# EAGLE design due (EAGLE 9.6.2)
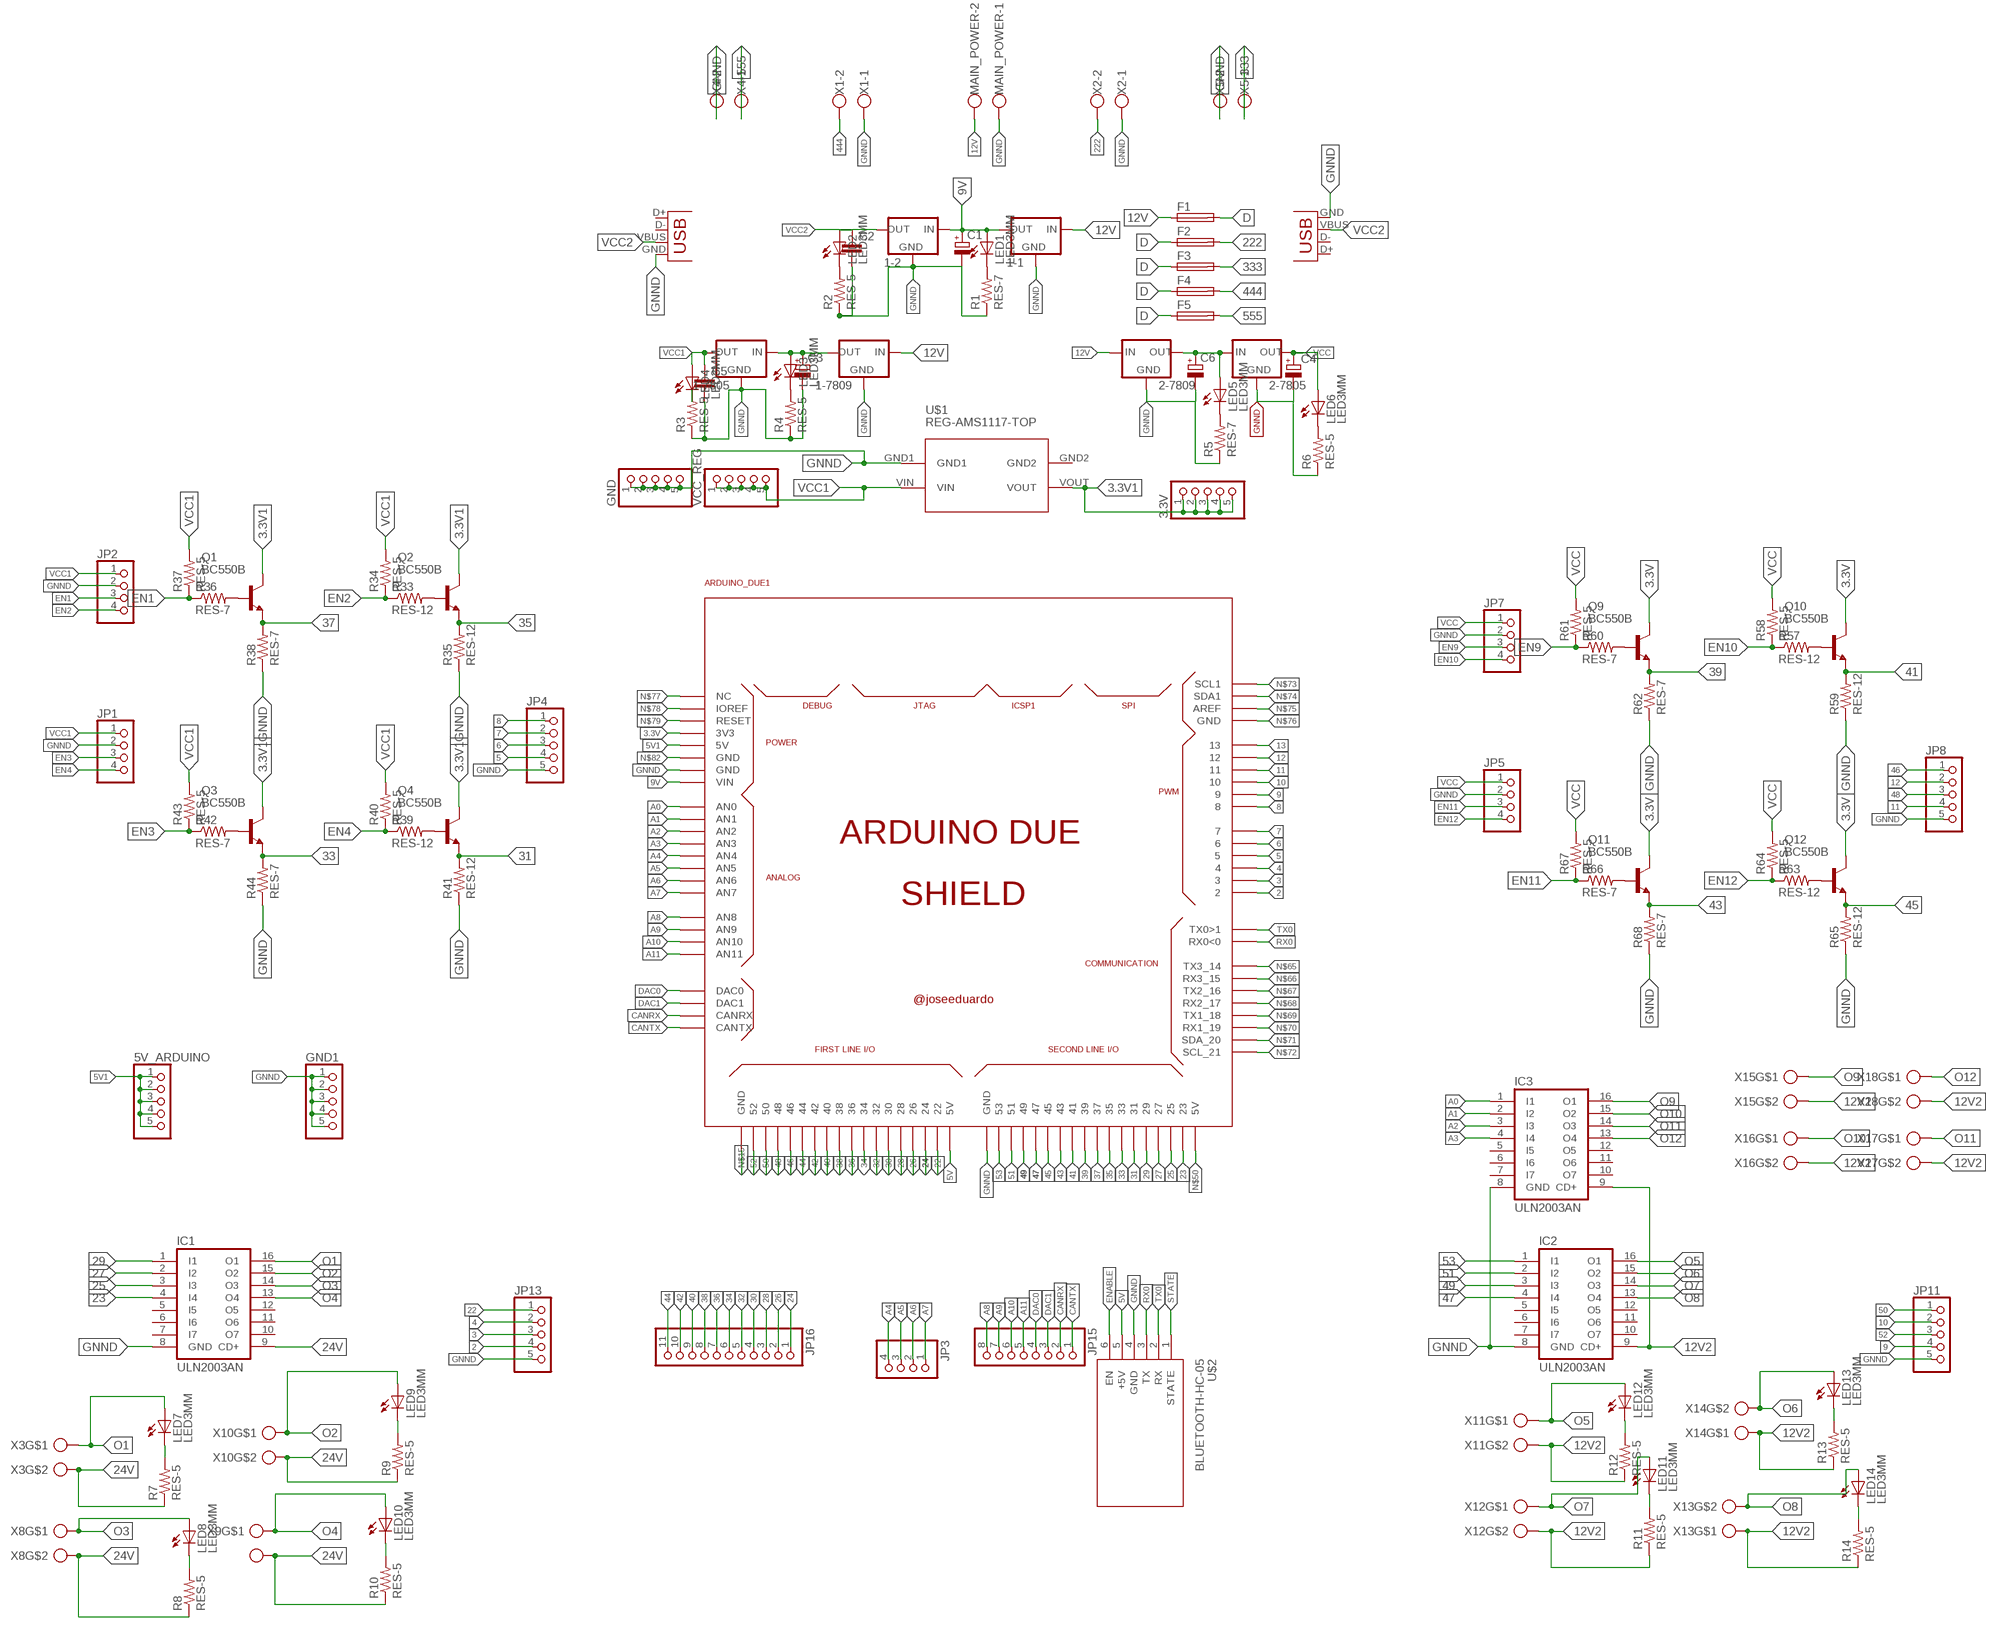
[diagram p0: schematic, sheet 1]

## Parts
1-1  78XXS  [78XXS]
1-2  78XXS  [78XXS]
1-7805  78XXS  [78XXS]
1-7809  78XXS  [78XXS]
2-7805  78XXS  [78XXS]
2-7809  78XXS  [78XXS]
3.3V  PINHD-1X5  [1X05]
5V_ARDUINO  PINHD-1X5  [1X05]
ARDUINO_DUE1  ARDUINO_DUE_SHIELD  [ARDUINO_DUE_SHIELD]
C1  CAP_POL  [E3,5-8]
C2  CAPACITOR  [C025-025X050]
C3  CAP_POL  [E3,5-8]
C4  CAP_POL  [E3,5-8]
C5  CAPACITOR  [C025-025X050]
C6  CAP_POL  [E3,5-8]
F1  FUSE_HOLDER  [SH22,5A]
F2  FUSE_HOLDER  [SH22,5A]
F3  FUSE_HOLDER  [SH22,5A]
F4  FUSE_HOLDER  [SH22,5A]
F5  FUSE_HOLDER  [SH22,5A]
GND  PINHD-1X5  [1X05]
GND1  PINHD-1X5  [1X05]
IC1  ULN2003AN  [DIL16]
IC2  ULN2003AN  [DIL16]
IC3  ULN2003AN  [DIL16]
JP1  PINHD-1X4  [1X04]
JP2  PINHD-1X4  [1X04]
JP3  PINHD-1X4  [1X04]
JP4  PINHD-1X5  [1X05]
JP5  PINHD-1X4  [1X04]
JP7  PINHD-1X4  [1X04]
JP8  PINHD-1X5  [1X05]
JP11  PINHD-1X5  [1X05]
JP13  PINHD-1X5  [1X05]
JP15  PINHD-1X8  [1X08]
JP16  PINHD-1X11  [1X11]
LED1  LED3MM  [LED3MM]
LED2  LED3MM  [LED3MM]
LED3  LED3MM  [LED3MM]
LED4  LED3MM  [LED3MM]
LED5  LED3MM  [LED3MM]
LED6  LED3MM  [LED3MM]
LED7  LED3MM  [LED3MM]
LED8  LED3MM  [LED3MM]
LED9  LED3MM  [LED3MM]
LED10  LED3MM  [LED3MM]
LED11  LED3MM  [LED3MM]
LED12  LED3MM  [LED3MM]
LED13  LED3MM  [LED3MM]
LED14  LED3MM  [LED3MM]
MAIN_POWER  ROSTA.POWER  [W239-302]
Q1  BC550B  [TO92-EBC]
Q2  BC550B  [TO92-EBC]
Q3  BC550B  [TO92-EBC]
Q4  BC550B  [TO92-EBC]
Q9  BC550B  [TO92-EBC]
Q10  BC550B  [TO92-EBC]
Q11  BC550B  [TO92-EBC]
Q12  BC550B  [TO92-EBC]
R1  RES-7  [0204/7]
R2  RES-5  [0204/5]
R3  RES-5  [0204/5]
R4  RES-5  [0204/5]
R5  RES-7  [0204/7]
R6  RES-5  [0204/5]
R7  RES-5  [0204/5]
R8  RES-5  [0204/5]
R9  RES-5  [0204/5]
R10  RES-5  [0204/5]
R11  RES-5  [0204/5]
R12  RES-5  [0204/5]
R13  RES-5  [0204/5]
R14  RES-5  [0204/5]
R33  RES-12  [0207/12]
R34  RES-5  [0204/5]
R35  RES-12  [0207/12]
R36  RES-7  [0204/7]
R37  RES-5  [0204/5]
R38  RES-7  [0204/7]
R39  RES-12  [0207/12]
R40  RES-5  [0204/5]
R41  RES-12  [0207/12]
R42  RES-7  [0204/7]
R43  RES-5  [0204/5]
R44  RES-7  [0204/7]
R57  RES-12  [0207/12]
R58  RES-5  [0204/5]
R59  RES-12  [0207/12]
R60  RES-7  [0204/7]
R61  RES-5  [0204/5]
R62  RES-7  [0204/7]
R63  RES-12  [0207/12]
R64  RES-5  [0204/5]
R65  RES-12  [0207/12]
R66  RES-7  [0204/7]
R67  RES-5  [0204/5]
R68  RES-7  [0204/7]
U$1  REG-AMS1117-TOP  [REG-AMS1117_TOP]
U$2  BLUETOOTH-HC-05  [WIRELESS-BLUETOOTH-HC-05]
VCC_REG  PINHD-1X5  [1X05]
X1  ROSTA.POWER  [W239-302]
X2  ROSTA.POWER  [W239-302]
X3  CON_PTR_2  [AK300/2]
X4  ROSTA.POWER  [W239-302]
X5  ROSTA.POWER  [W239-302]
X6  USB-A-H  [USB-A-H]
X7  USB-A-H  [USB-A-H]
X8  CON_PTR_2  [AK300/2]
X9  CON_PTR_2  [AK300/2]
X10  CON_PTR_2  [AK300/2]
X11  CON_PTR_2  [AK300/2]
X12  CON_PTR_2  [AK300/2]
X13  CON_PTR_2  [AK300/2]
X14  CON_PTR_2  [AK300/2]
X15  CON_PTR_2  [AK300/2]
X16  CON_PTR_2  [AK300/2]
X17  CON_PTR_2  [AK300/2]
X18  CON_PTR_2  [AK300/2]

## Nets
2: ARDUINO_DUE1.2 JP13.4
3: ARDUINO_DUE1.3 JP13.3
3.3V: ARDUINO_DUE1.3V3 Q9.C Q10.C Q11.C Q12.C
3.3V1: 3.3V.1 3.3V.2 3.3V.3 3.3V.4 3.3V.5 Q1.C Q2.C Q3.C Q4.C U$1.VOUT
4: ARDUINO_DUE1.4 JP13.2
5: ARDUINO_DUE1.5 JP4.4
5V: ARDUINO_DUE1.5V0_1(5V) U$2.5(+5V)
5V1: 5V_ARDUINO.1 5V_ARDUINO.2 5V_ARDUINO.3 5V_ARDUINO.4 5V_ARDUINO.5 ARDUINO_DUE1.5V0(5V)
6: ARDUINO_DUE1.6 JP4.3
7: ARDUINO_DUE1.7 JP4.2
8: ARDUINO_DUE1.8 JP4.1
9: ARDUINO_DUE1.9 JP11.4
9V: 1-1.OUT 1-2.IN ARDUINO_DUE1.VIN C1.+ LED1.A
10: ARDUINO_DUE1.10 JP11.2
11: ARDUINO_DUE1.11 JP8.4
12: ARDUINO_DUE1.12 JP8.2
12V: 1-1.IN 1-7809.IN 2-7809.IN F1.1 MAIN_POWER.2
12V2: IC2.9(CD+) IC3.9(CD+) R11.1 R12.1 R13.1 R14.1 X11.2 X12.2 X13.1 X14.1 X15.2 X16.2 X17.2 X18.2
13: ARDUINO_DUE1.13
22: ARDUINO_DUE1.22 JP13.1
23: ARDUINO_DUE1.23 IC1.4(I4)
24: ARDUINO_DUE1.24 JP16.1
24V: IC1.9(CD+) R7.1 R8.1 R9.1 R10.1 X3.2 X8.2 X9.2 X10.2
25: ARDUINO_DUE1.25 IC1.3(I3)
26: ARDUINO_DUE1.26 JP16.2
27: ARDUINO_DUE1.27 IC1.2(I2)
28: ARDUINO_DUE1.28 JP16.3
29: ARDUINO_DUE1.29 IC1.1(I1)
30: ARDUINO_DUE1.30 JP16.4
31: ARDUINO_DUE1.31 Q4.E R41.2
32: ARDUINO_DUE1.32 JP16.5
33: ARDUINO_DUE1.33 Q3.E R44.2
34: ARDUINO_DUE1.34 JP16.6
35: ARDUINO_DUE1.35 Q2.E R35.2
36: ARDUINO_DUE1.36 JP16.7
37: ARDUINO_DUE1.37 Q1.E R38.2
38: ARDUINO_DUE1.38 JP16.8
39: ARDUINO_DUE1.39 Q9.E R62.2
40: ARDUINO_DUE1.40 JP16.9
41: ARDUINO_DUE1.41 Q10.E R59.2
42: ARDUINO_DUE1.42 JP16.10
43: ARDUINO_DUE1.43 Q11.E R68.2
44: ARDUINO_DUE1.44 JP16.11
45: ARDUINO_DUE1.45 Q12.E R65.2
46: ARDUINO_DUE1.46 JP8.1
47: ARDUINO_DUE1.47 IC2.4(I4)
48: ARDUINO_DUE1.48 JP8.3
49: ARDUINO_DUE1.49 IC2.3(I3)
50: ARDUINO_DUE1.50 JP11.1
51: ARDUINO_DUE1.51 IC2.2(I2)
52: ARDUINO_DUE1.52 JP11.3
53: ARDUINO_DUE1.53 IC2.1(I1)
222: F2.2 X2.2
333: F3.2 X5.1
444: F4.2 X1.2
555: F5.2 X4.1
A0: ARDUINO_DUE1.A0(AN0) IC3.1(I1)
A1: ARDUINO_DUE1.A1(AN1) IC3.2(I2)
A2: ARDUINO_DUE1.A2(AN2) IC3.3(I3)
A3: ARDUINO_DUE1.A3(AN3) IC3.4(I4)
A4: ARDUINO_DUE1.A4(AN4) JP3.4
A5: ARDUINO_DUE1.A5(AN5) JP3.3
A6: ARDUINO_DUE1.A6(AN6) JP3.2
A7: ARDUINO_DUE1.A7(AN7) JP3.1
A8: ARDUINO_DUE1.A8(AN8) JP15.8
A9: ARDUINO_DUE1.A9(AN9) JP15.7
A10: ARDUINO_DUE1.A10(AN10) JP15.6
A11: ARDUINO_DUE1.A11(AN11) JP15.5
CANRX: ARDUINO_DUE1.CANRX JP15.2
CANTX: ARDUINO_DUE1.CANTX JP15.1
D: F1.2 F2.1 F3.1 F4.1 F5.1
DAC0: ARDUINO_DUE1.DAC0 JP15.4
DAC1: ARDUINO_DUE1.DAC1 JP15.3
EN1: JP2.3 R36.1 R37.1
EN2: JP2.4 R33.1 R34.1
EN3: JP1.3 R42.1 R43.1
EN4: JP1.4 R39.1 R40.1
EN9: JP7.3 R60.1 R61.1
EN10: JP7.4 R57.1 R58.1
EN11: JP5.3 R66.1 R67.1
EN12: JP5.4 R63.1 R64.1
ENABLE: U$2.6(EN)
GNND: 1-1.GND 1-2.GND 1-7805.GND 1-7809.GND 2-7805.GND 2-7809.GND ARDUINO_DUE1.GND_1(GND) ARDUINO_DUE1.GND_3(GND) C1.- C2.2 C3.- C4.- C5.2 C6.- GND1.1 GND1.2 GND1.3 GND1.4 GND1.5 GND.1 GND.2 GND.3 GND.4 GND.5 IC1.8(GND) IC2.8(GND) IC3.8(GND) JP1.2 JP2.2 JP4.5 JP5.2 JP7.2 JP8.5 JP11.5 JP13.5 MAIN_POWER.1 R1.1 R2.1 R3.1 R4.1 R5.1 R6.1 R35.1 R38.1 R41.1 R44.1 R59.1 R62.1 R65.1 R68.1 U$1.GND1 U$2.4(GND) X1.1 X2.1 X4.2 X5.2 X6.GND X7.GND
N$2: LED12.K(C) R12.2
N$3: LED1.K(C) R1.2
N$7: C2.1 LED2.A
N$8: LED4.K(C) R3.2
N$9: LED3.K(C) R4.2
N$10: 2-7805.IN 2-7809.OUT C6.+ LED5.A
N$11: LED2.K(C) R2.2
N$12: LED5.K(C) R5.2
N$13: LED6.K(C) R6.2
N$14: LED11.K(C) R11.2
N$15: ARDUINO_DUE1.GND_2(GND)
N$16: LED13.K(C) R13.2
N$17: LED14.K(C) R14.2
N$18: LED10.K(C) R10.2
N$19: LED9.K(C) R9.2
N$20: 1-7805.IN 1-7809.OUT C3.+ LED3.A
N$21: LED8.K(C) R8.2
N$22: LED7.K(C) R7.2
N$30: Q2.B R33.2
N$31: Q1.B R36.2
N$33: Q4.B R39.2
N$34: Q3.B R42.2
N$39: Q10.B R57.2
N$40: Q9.B R60.2
N$41: Q12.B R63.2
N$42: Q11.B R66.2
N$50: ARDUINO_DUE1.5V0_2(5V)
N$65: ARDUINO_DUE1.14(TX3_14)
N$66: ARDUINO_DUE1.15(RX3_15)
N$67: ARDUINO_DUE1.16(TX2_16)
N$68: ARDUINO_DUE1.17(RX2_17)
N$69: ARDUINO_DUE1.18(TX1_18)
N$70: ARDUINO_DUE1.19(RX1_19)
N$71: ARDUINO_DUE1.20(SDA_20)
N$72: ARDUINO_DUE1.21(SCL_21)
N$73: ARDUINO_DUE1.SCL1
N$74: ARDUINO_DUE1.SDA1
N$75: ARDUINO_DUE1.AREF
N$76: ARDUINO_DUE1.GND_4(GND)
N$77: ARDUINO_DUE1.NC_2(NC)
N$78: ARDUINO_DUE1.IOREF
N$79: ARDUINO_DUE1.RESET
N$82: ARDUINO_DUE1.GND
O1: IC1.16(O1) LED7.A X3.1
O2: IC1.15(O2) LED9.A X10.1
O3: IC1.14(O3) LED8.A X8.1
O4: IC1.13(O4) LED10.A X9.1
O5: IC2.16(O1) LED12.A X11.1
O6: IC2.15(O2) LED13.A X14.2
O7: IC2.14(O3) LED11.A X12.1
O8: IC2.13(O4) LED14.A X13.2
O9: IC3.16(O1) X15.1
O10: IC3.15(O2) X16.1
O11: IC3.14(O3) X17.1
O12: IC3.13(O4) X18.1
RX0: ARDUINO_DUE1.0(RX0<0) U$2.3(TX)
STATE: U$2.1(STATE)
TX0: ARDUINO_DUE1.1(TX0>1) U$2.2(RX)
VCC: 2-7805.OUT C4.+ JP5.1 JP7.1 LED6.A R58.2 R61.2 R64.2 R67.2
VCC1: 1-7805.OUT C5.1 JP1.1 JP2.1 LED4.A R34.2 R37.2 R40.2 R43.2 U$1.VIN VCC_REG.1 VCC_REG.2 VCC_REG.3 VCC_REG.4 VCC_REG.5
VCC2: 1-2.OUT X6.VBUS X7.VBUS
Unconnected: IC1.5(I5) IC1.6(I6) IC1.7(I7) IC1.10(O7) IC1.11(O6) IC1.12(O5) IC2.5(I5) IC2.6(I6) IC2.7(I7) IC2.10(O7) IC2.11(O6) IC2.12(O5) IC3.5(I5) IC3.6(I6) IC3.7(I7) IC3.10(O7) IC3.11(O6) IC3.12(O5) U$1.GND2 X6.D+ X6.D- X7.D+ X7.D-

## Library data of the parts
1-1 1-2 1-7805 1-7809 2-7805 2-7809 = MIA_LIBRARY-2-2-2:78XXS: VOLTAGE REGULATOR
3.3V 5V_ARDUINO GND GND1 JP4 JP8 JP11 JP13 VCC_REG = pinhead:PINHD-1X5: PIN HEADER
ARDUINO_DUE1 = MIA_LIBRARY-2-2-2:ARDUINO_DUE_SHIELD
C1 C3 C4 C6 = MIA_LIBRARY-2-2-2:CAP_POL
C2 C5 = MIA_LIBRARY-2-2-2:CAPACITOR
F1-F5 = MIA_LIBRARY-2-2-2:FUSE_HOLDER
IC1-IC3 = MIA_LIBRARY-2-2-2:ULN2003A: DRIVER ARRAY
JP1-JP3 JP5 JP7 = pinhead:PINHD-1X4: PIN HEADER
JP15 = pinhead:PINHD-1X8: PIN HEADER
JP16 = pinhead:PINHD-1X11: PIN HEADER
LED1-LED14 = MIA_LIBRARY-2-2-2:LED3MM
MAIN_POWER X1 X2 X4 X5 = MIA_LIBRARY-2-2-2:ROSTA.POWER: WAGO SCREW CLAMP; OC_FARNELL: unknown; OC_NEWARK: unknown
Q1-Q4 Q9-Q12 = transistor-npn:BC550*: NPN Transistor
R1 R5 R36 R38 R42 R44 R60 R62 R66 R68 = MIA_LIBRARY-2-2-2:RES-7
R2-R4 R6-R14 R34 R37 R40 R43 R58 R61 R64 R67 = MIA_LIBRARY-2-2-2:RES-5
R33 R35 R39 R41 R57 R59 R63 R65 = MIA_LIBRARY-2-2-2:RES-12
U$1 = MIA_LIBRARY-2-2-2:REG-AMS1117-TOP: Linear Regulator based on AMS1117 chip
U$2 = MIA_LIBRARY-2-2-2:BLUETOOTH-HC-05: Bluetooth Transceiver Module based on HC-05 board Tutorial is available here: https://arduino-info.wikispaces.com/BlueTooth-HC05-HC06-Modules-How-To Click here to find device on ebay.com <http://www.ebay.com/sch/hc-05+module+rs232>
X3 X8-X18 = MIA_LIBRARY-2-2-2:CON_PTR_2
X6 X7 = MIA_LIBRARY-2-2-2:USB: USB Connectors

## Board
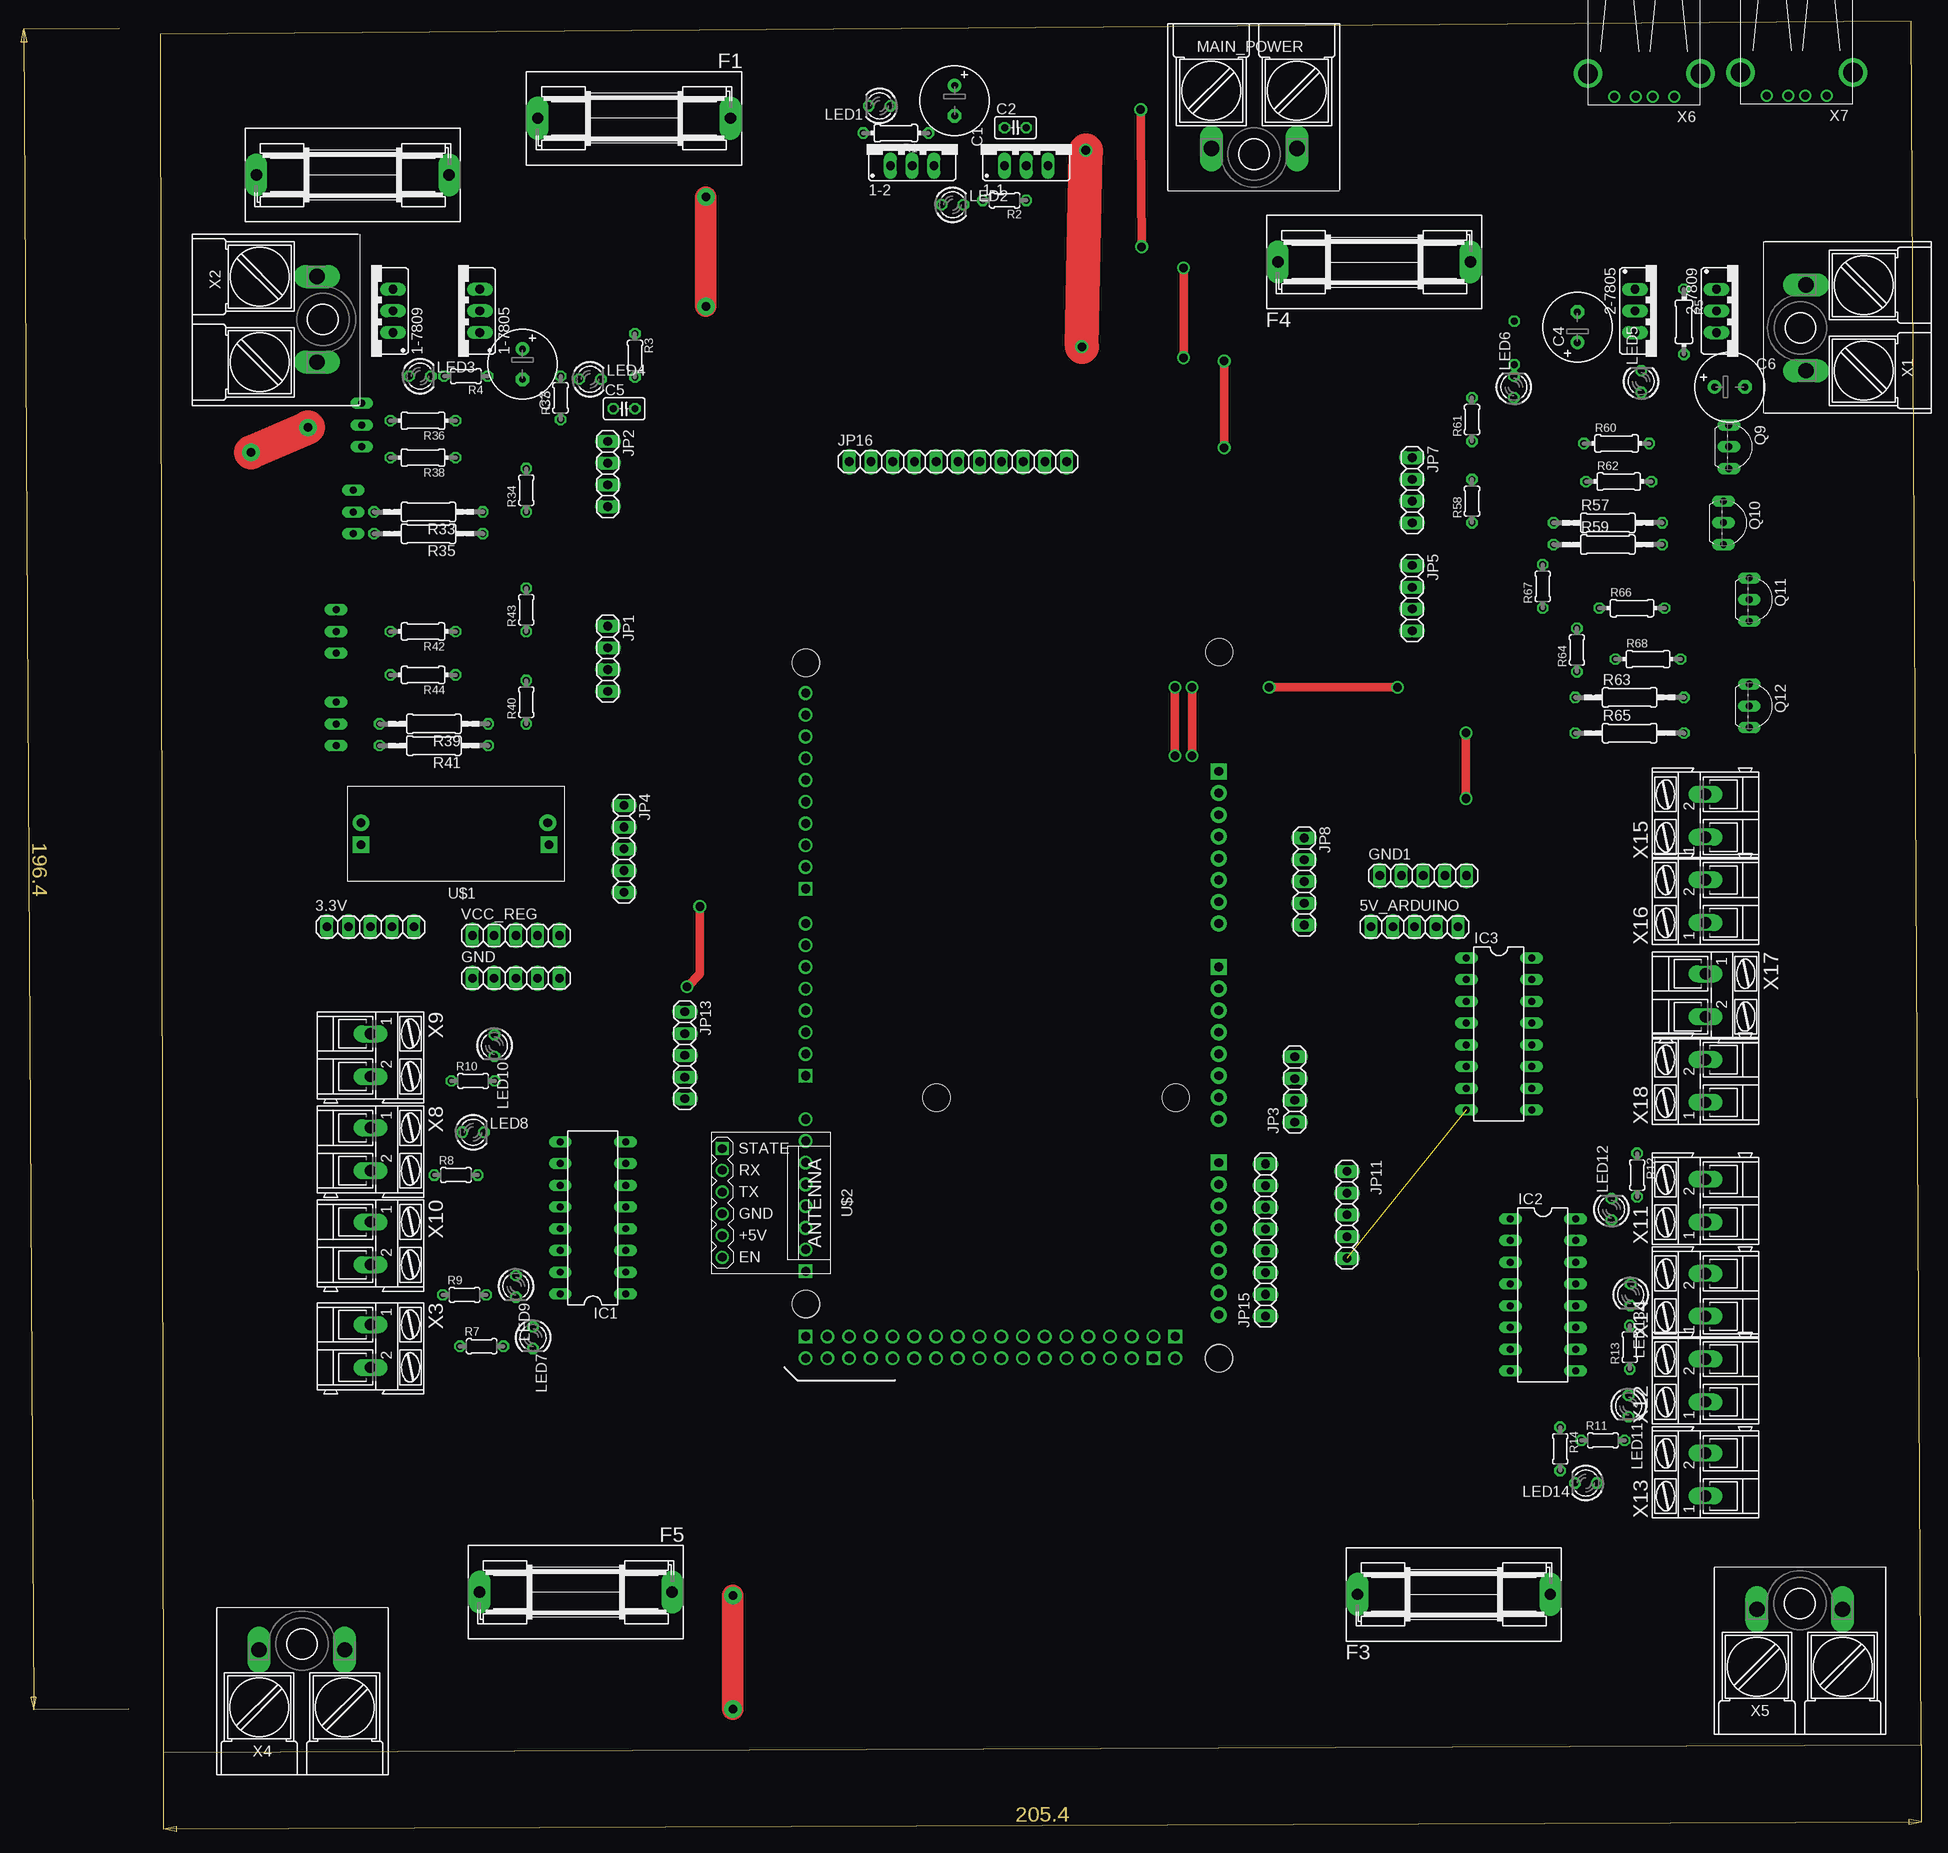
[diagram p1: board, top side]
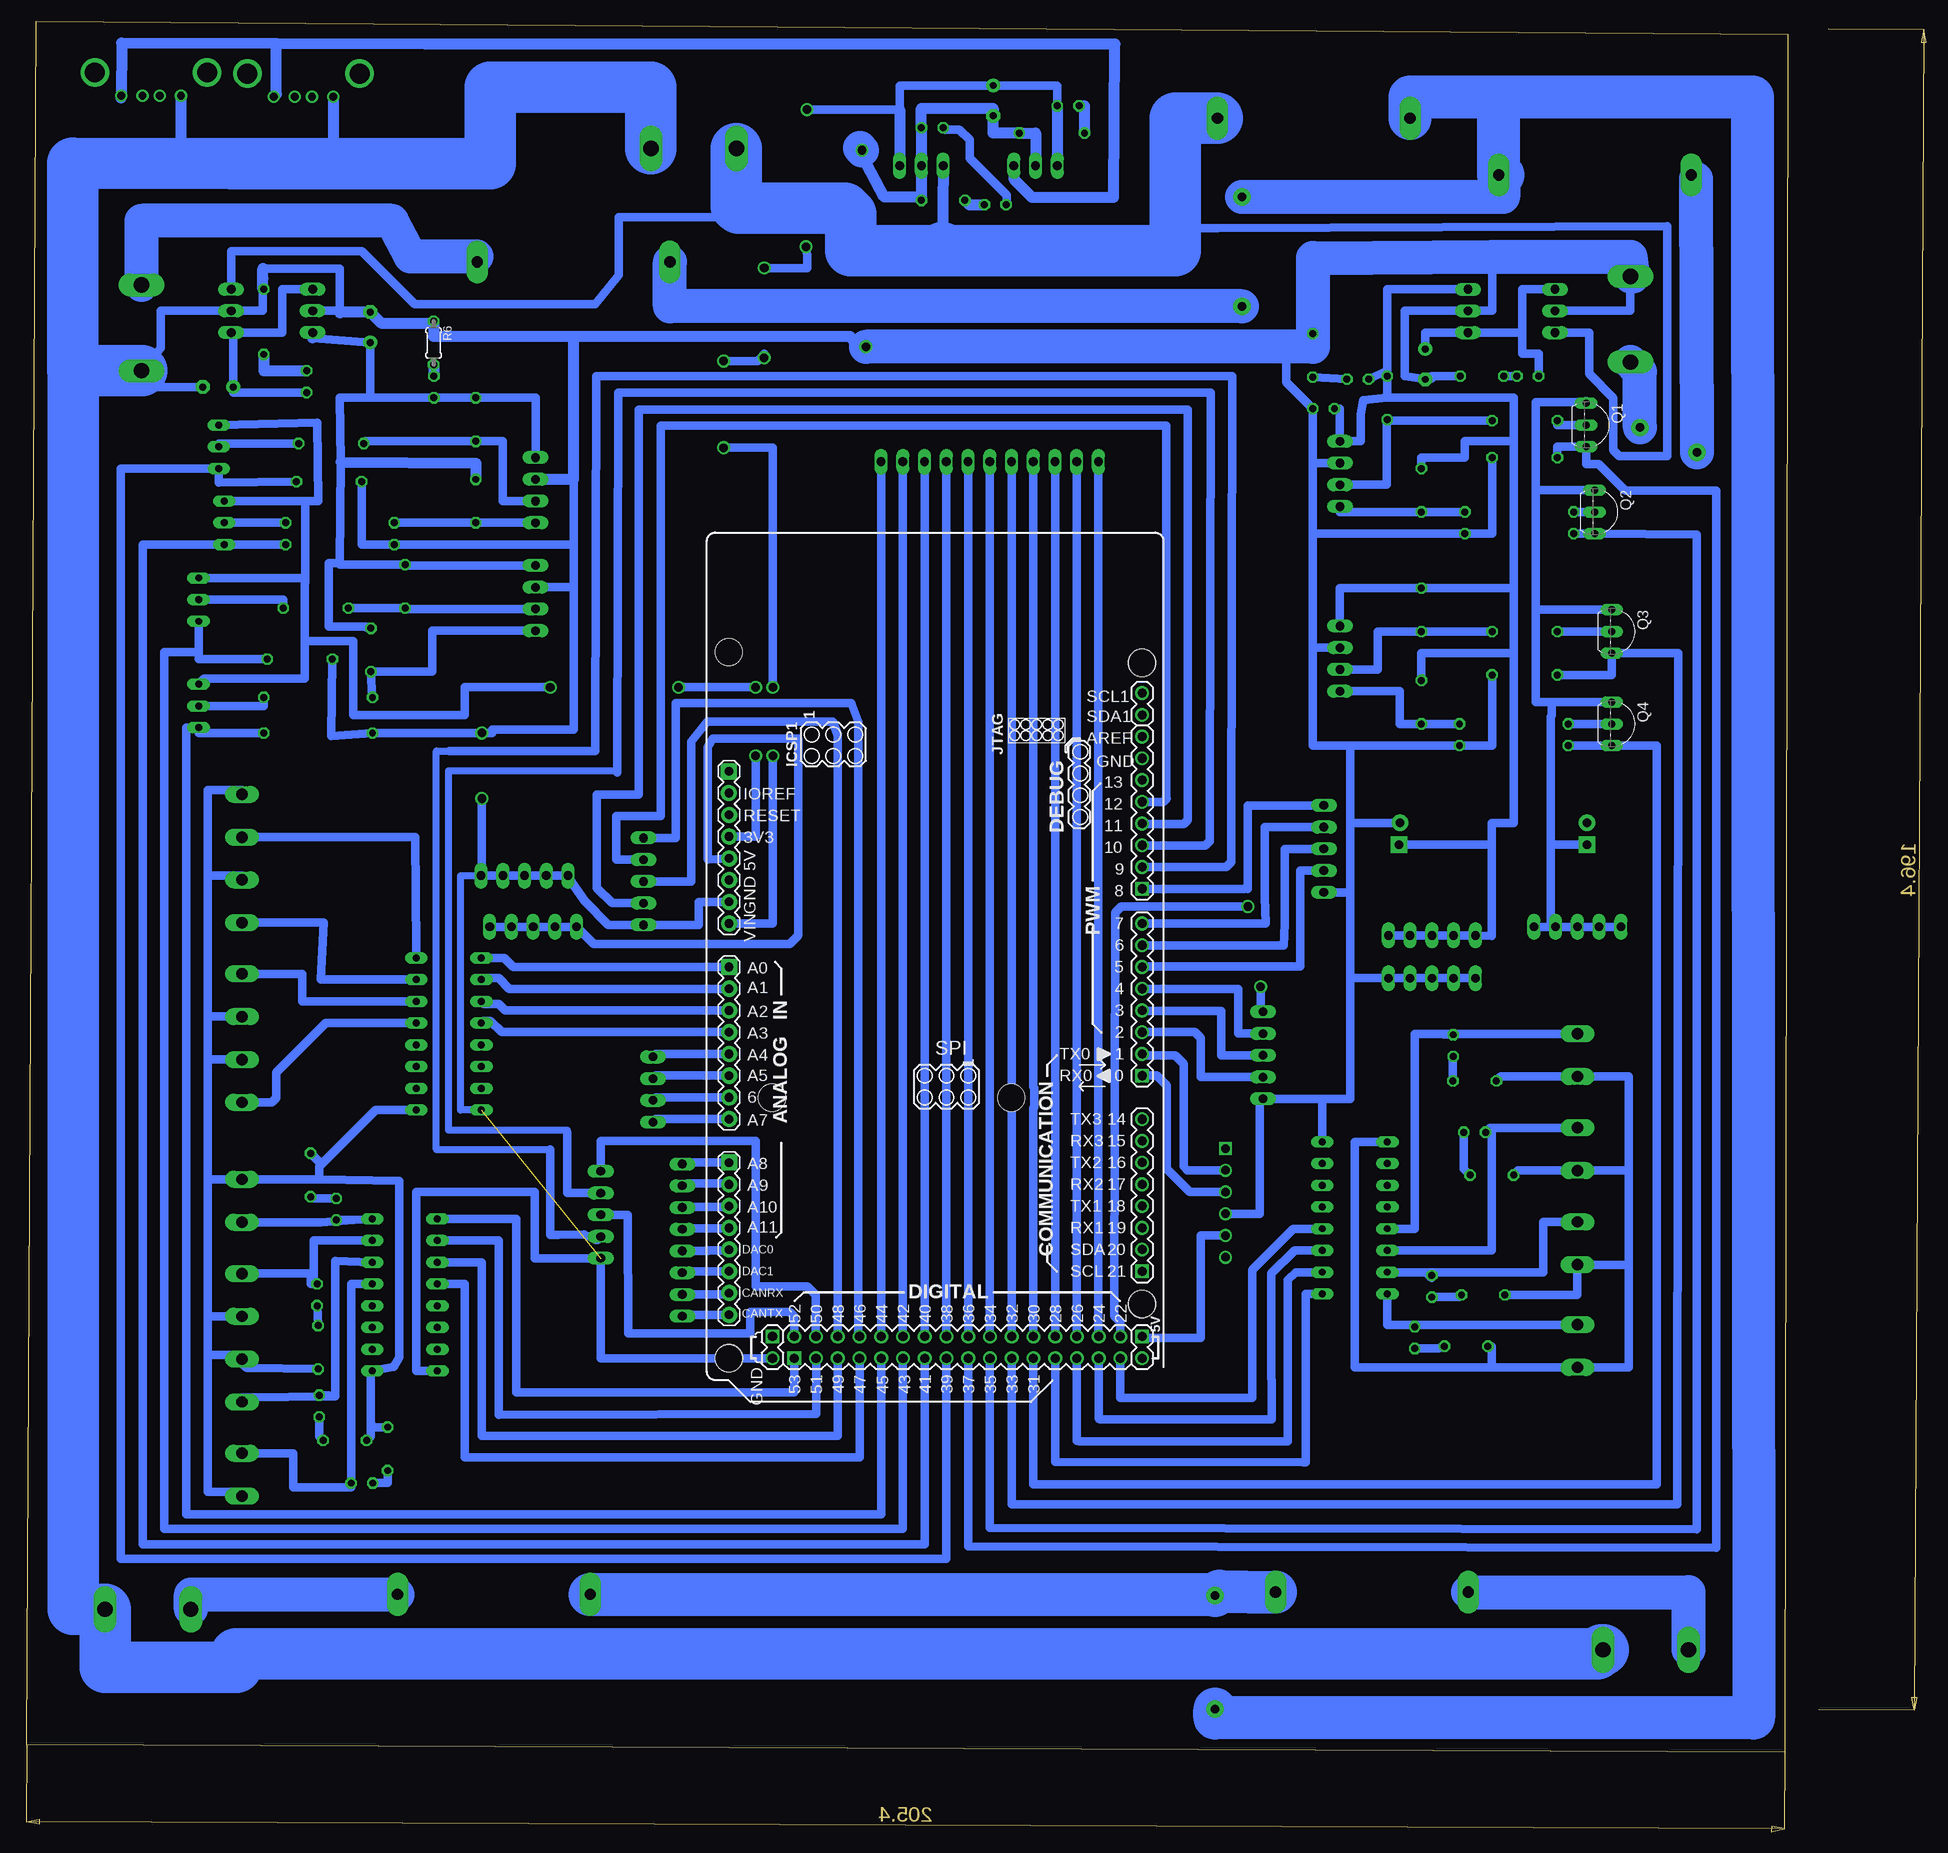
[diagram p2: board, bottom side, seen from below]

Size 205.74 x 202.27 mm. Coordinates in mm from the lower left corner, seen from the top.
Outline: 0.35,0 205.74,0.87 204.62,202.27 0,200.76 0.35,0
Copper layers (1*16): Top 0.035mm / dielectric 1.5mm / Bottom 0.035mm
Design rules "default *": minimum track width 0.8mm, minimum drill 0.6mm, track to track 0.6mm, track to pad 0.6mm, pad to pad 6mil, via to via 6mil, smd to smd 6mil, copper to edge 0.6mm, drill to drill 6mil, minimum pad ring 10mil, minimum via ring 8mil, stop-mask expansion 4mil, vias tented up to drill 0mil, thermal gap 10mil

### Footprints (pad centres in the part's own frame; a part is rotated, then mirrored left to right if it is on the bottom)
78XXS = drill 1.016 long: GND 0,-2.54; IN -2.54,-2.54; OUT 2.54,-2.54
1X05 = drill 1.016 long: 1 -5.08,0; 2 -2.54,0; 3 0,0; 4 2.54,0; 5 5.08,0
ARDUINO_DUE_SHIELD = drill 1.067 square: 0 63.373,51.816; 5V0_1 93.853,51.816; 8 41.529,51.816; 21 86.233,51.816; 53 96.393,11.176; GND_2 93.853,8.636 | drill 1.067: 1 60.833,51.816; 2 58.293,51.816; 3 55.753,51.816; 4 53.213,51.816; 5 50.673,51.816; 5V0_2 96.393,51.816; 6 48.133,51.816; 7 45.593,51.816; 9 38.989,51.816; 10 36.449,51.816; 11 33.909,51.816; 12 31.369,51.816; 13 28.829,51.816; 14 68.453,51.816; 15 70.993,51.816; 16 73.533,51.816; 17 76.073,51.816; 18 78.613,51.816; 19 81.153,51.816; 20 83.693,51.816; 22 93.853,49.276; 23 96.393,49.276; 24 93.853,46.736; 25 96.393,46.736; 26 93.853,44.196; 27 96.393,44.196; 28 93.853,41.656; 29 96.393,41.656; 30 93.853,39.116; 31 96.393,39.116; 32 93.853,36.576; 33 96.393,36.576; 34 93.853,34.036; 35 96.393,34.036; 36 93.853,31.496; 37 96.393,31.496; 38 93.853,28.956; 39 96.393,28.956; 40 93.853,26.416; 41 96.393,26.416; 42 93.853,23.876; 43 96.393,23.876; 44 93.853,21.336; 45 96.393,21.336; 46 93.853,18.796; 47 96.393,18.796; 48 93.853,16.256; 49 96.393,16.256; 50 93.853,13.716; 51 96.393,13.716; 52 93.853,11.176; AREF 23.749,51.816; GND_3 96.393,8.636; GND_4 26.289,51.816; SCL1 18.669,51.816; SDA1 21.209,51.816 | drill 1.016 pad 1.88: 3V3 35.433,3.556; 5V0 37.973,3.556; A1 53.213,3.556; A2 55.753,3.556; A3 58.293,3.556; A4 60.833,3.556; A5 63.373,3.556; A6 65.913,3.556; A7 68.453,3.556; A9 76.073,3.556; A10 78.613,3.556; A11 81.153,3.556; CANRX 88.773,3.556; CANTX 91.313,3.556; DAC0 83.693,3.556; DAC1 86.233,3.556; GND 40.513,3.556; GND_1 43.053,3.556; IOREF 30.346,3.543; RESET 32.893,3.555; VIN 45.593,3.556 | drill 1.016 pad 1.88 square: A0 50.673,3.556; A8 73.533,3.556; NC_2 27.806,3.543 | hole 3.2: 15.113,51.816; 90.043,51.816; 96.393,3.556; 96.418,3.505; 15.138,51.765; 90.068,51.765; 13.868,3.505; 65.938,36.525; 65.938,8.585
E3,5-8 = drill 0.813 pad 1.6: + -1.778,0 | drill 0.813 pad 1.6 octagon: - 1.778,0
C025-025X050 = drill 0.813 octagon: 1 -1.27,0; 2 1.27,0
SH22,5A = drill 1.321 pad 2.54 long: 1 -11.252,0; 2 11.252,0
DIL16 = drill 0.813 long: 1 -8.89,-3.81; 2 -6.35,-3.81; 3 -3.81,-3.81; 4 -1.27,-3.81; 5 1.27,-3.81; 6 3.81,-3.81; 7 6.35,-3.81; 8 8.89,-3.81; 9 8.89,3.81; 10 6.35,3.81; 11 3.81,3.81; 12 1.27,3.81; 13 -1.27,3.81; 14 -3.81,3.81; 15 -6.35,3.81; 16 -8.89,3.81
1X04 = drill 1.016 long: 1 -3.81,0; 2 -1.27,0; 3 1.27,0; 4 3.81,0
1X08 = drill 1.016 long: 1 -8.89,0; 2 -6.35,0; 3 -3.81,0; 4 -1.27,0; 5 1.27,0; 6 3.81,0; 7 6.35,0; 8 8.89,0
1X11 = drill 1.016 long: 1 -12.7,0; 2 -10.16,0; 3 -7.62,0; 4 -5.08,0; 5 -2.54,0; 6 0,0; 7 2.54,0; 8 5.08,0; 9 7.62,0; 10 10.16,0; 11 12.7,0
LED3MM = drill 0.813 octagon: A -1.27,0; K 1.27,0
W239-302 = drill 1.8 long: 1 -5,5; 2 5,5
TO92-EBC = drill 0.813 long: B 0,-1.27; C -2.54,-1.27; E 2.54,-1.27
0204/7 = drill 0.813 octagon: 1 -3.81,0; 2 3.81,0
0204/5 = drill 0.813 octagon: 1 -2.54,0; 2 2.54,0
0207/12 = drill 0.813 octagon: 1 -6.35,0; 2 6.35,0
REG-AMS1117_TOP = drill 1 pad 1.93: GND1 -13.843,-1.27; GND2 8.001,-1.27 | drill 1 pad 1.93 square: VIN -13.97,1.27; VOUT 8.001,1.27
WIRELESS-BLUETOOTH-HC-05 = drill 1 square: 1 -6.35,-17.145 | drill 1: 2 -3.81,-17.145; 3 -1.27,-17.145; 4 1.27,-17.145; 5 3.81,-17.145; 6 6.35,-17.145
AK300/2 = drill 1.321 long: 1 -2.515,0; 2 2.489,0
USB-A-H = drill 0.914: D+ 2.718,-1.003; D- 2.718,1.003; GND 2.718,-3.493; VBUS 2.718,3.493 | drill 2.311: P$5 0,-6.566; P$6 0,6.566

### Placement (x,y rotation side)
1-1  101.2,187.94 0 top
1-2  87.87,187.94 0 top
1-7805  34.81,168.43 90 top
1-7809  24.65,168.43 90 top
2-7805  174.86,168.43 270 top
2-7809  184.39,168.43 270 top
3.3V  24.57,96.45 0 top
5V_ARDUINO  146.57,96.45 0 top
ARDUINO_DUE1  127.23,142.43 270 bottom
C1  92.82,193 270 top
C2  99.93,189.85 0 top
C3  42.34,162.21 270 top
C4  165.59,166.53 90 top
C5  54.21,157 0 top
C6  183.39,159.54 0 top
F1  55.37,190.94 180 top
F2  22.51,184.31 180 top
F3  151.15,18.44 0 top
F4  141.84,174.15 0 top
F5  48.57,18.7 180 top
GND  41.57,90.45 0 top
GND1  147.57,102.45 0 top
IC1  50.57,62.45 90 top
IC2  161.57,53.45 270 top
IC3  156.43,83.94 270 top
JP1  52.31,127.79 270 top
JP2  52.31,149.38 270 top
JP3  132.57,77.45 90 top
JP4  54.2,105.57 270 top
JP5  146.29,134.87 270 top
JP7  146.29,147.48 270 top
JP8  133.67,101.76 270 top
JP11  138.67,62.8 270 top
JP13  61.31,81.44 270 top
JP15  129.14,59.85 90 top
JP16  93.22,150.81 0 top
LED1  84.06,192.39 180 top
LED2  92.58,180.84 0 top
LED3  30.37,160.81 0 top
LED4  50.23,160.45 0 top
LED5  173.04,160.18 90 top
LED6  158.16,159.54 90 top
LED7  43.57,48.45 270 top
LED8  36.57,72.45 0 top
LED9  41.57,54.45 270 top
LED10  39.06,82.58 270 top
LED11  171.57,40.45 270 top
LED12  169.57,63.45 90 top
LED13  171.81,53.45 270 top
LED14  166.57,31.45 180 top
MAIN_POWER  127.82,192.41 180 top
Q1  22.29,155.1 270 bottom
Q2  21.29,144.94 270 bottom
Q3  19.29,130.97 270 bottom
Q4  19.29,120.17 270 bottom
Q9  184.56,152.56 270 top
Q10  183.93,143.67 270 top
Q11  186.93,134.7 270 top
Q12  186.93,122.27 270 top
R1  85.96,189.21 180 top
R2  98.66,181.36 180 top
R3  55.48,163.23 270 top
R4  35.72,160.81 180 top
R5  178.04,167.16 270 top
R6  158.2,164.69 270 bottom
R7  37.57,47.45 0 top
R8  34.57,67.45 0 top
R9  35.57,53.45 0 top
R10  36.57,78.45 0 top
R11  168.57,36.45 0 top
R12  172.57,67.45 270 top
R13  171.69,47.32 90 top
R14  163.57,35.45 270 top
R33  31.35,144.94 180 top
R34  42.78,147.48 90 top
R35  31.35,142.4 180 top
R36  30.72,155.61 180 top
R37  46.78,158.27 90 top
R38  30.72,151.29 180 top
R39  31.99,120.17 180 top
R40  42.78,122.71 90 top
R41  31.99,117.63 180 top
R42  30.72,130.97 180 top
R43  42.78,133.51 90 top
R44  30.72,125.89 180 top
R57  169.15,143.67 0 top
R58  153.27,146.21 90 top
R59  169.15,141.13 0 top
R60  170.16,152.94 0 top
R61  153.27,155.73 90 top
R62  170.42,148.49 0 top
R63  171.69,123.27 0 top
R64  165.53,128.81 90 top
R65  171.69,119.09 0 top
R66  171.96,133.7 0 top
R67  161.53,136.24 90 top
R68  173.83,127.75 0 top
U$1  31.45,107.33 180 top
U$2  82.82,64.19 270 top
VCC_REG  41.57,95.45 0 top
X1  197.32,166.45 90 top
X2  13.35,167.45 270 top
X3  24.57,47.45 270 top
X4  16.57,6.97 0 top
X5  191.57,11.7 0 top
X6  173.4,196.17 270 top
X7  191.21,196.31 270 top
X8  24.57,70.45 270 top
X9  24.57,81.45 270 top
X10  24.57,59.45 270 top
X11  180.57,64.45 90 top
X12  180.57,43.45 90 top
X13  180.57,32.45 90 top
X14  180.57,53.45 90 top
X15  180.57,109.45 90 top
X16  180.57,99.45 90 top
X17  180.57,88.45 270 top
X18  180.57,78.45 90 top

### Tracks (layer width: path | path; a pad name or v marks a point on that pad's centre or on a via)
2
  Bottom 1.016: JP13.4 68.57,78.9 68.57,83.45 69.26,84.14 ARDUINO_DUE1.2
3
  Bottom 1.016: JP13.3 66.2,81.44 66.2,86.65 75.38,86.65 ARDUINO_DUE1.3
3.3V  (via drill 1 pad 1.3)
  Top 1.016: v120.57,116.45 v120.57,124.45 | v129.57,124.45 v144.57,124.45
  Bottom 1: Q12.C 184.98,125.49 173.23,125.49 173.23,126.45 | Q11.C 173.23,137.24 173.23,136.68
  Bottom 1.016: Q9.C 171.81,155.35 171.69,146.21 173.2,146.21 | Q10.C 173.2,146.21 | 173.2,146.21 173.2,136.68 173.23,136.68 173.23,129.83 | 173.23,126.45 173.23,129.83 | ARDUINO_DUE1.3V3 120.57,107 v120.57,116.45 | v120.57,124.45 v129.57,124.45 | v144.57,124.45 154.57,124.45 154.57,121.19 167.57,121.19 167.57,129.83 173.23,129.83
3.3V1
  Bottom 1: 3.3V.4 3.3V.3
  Bottom 1.016: 27.57,122.71 29.45,122.71 29.45,133.51 | 27.57,122.71 Q4.C | 29.45,133.51 Q3.C | 29.45,133.51 29.45,147.48 | 29.45,147.48 Q2.C | 29.45,147.48 29.45,157.76 23.56,157.76 | 27.57,122.71 27.57,121.15 27.69,121.03 27.69,106.06 | 27.69,106.06 U$1.VOUT | 3.3V.1 3.3V.2 3.3V.3 | 3.3V.5 3.3V.4 27.69,97.03 27.69,106.06
  Bottom 1.27: 23.56,157.76 Q1.C
4
  Bottom 1.016: JP13.2 64.17,83.98 64.17,89.19 75.38,89.19 ARDUINO_DUE1.4
5
  Bottom 1.016: JP4.4 56.95,103.03 56.95,91.83 75.11,91.83 ARDUINO_DUE1.5
5V
  Bottom 1: 68.55,59.93 68.55,60.38 U$2.5
  Bottom 1.016: 68.55,59.93 68.55,48.42 75.42,48.42 75.57,48.7 ARDUINO_DUE1.5V0_1
5V1
  Bottom 1.016: ARDUINO_DUE1.5V0 126.19,104.35 126.19,117.45 125.57,118.45 115.57,118.45 115.57,95.45 116.57,94.45 139.49,94.45 5V_ARDUINO.1 5V_ARDUINO.2 5V_ARDUINO.3 5V_ARDUINO.4 5V_ARDUINO.5
6
  Bottom 1.016: JP4.3 58.78,105.57 58.78,96.81 58.88,94.3 ARDUINO_DUE1.6
7
  Bottom 1.016: JP4.2 61.07,108.11 61.07,99.94 61,96.84 ARDUINO_DUE1.7
8
  Bottom 1.016: JP4.1 63.09,110.65 63.09,103.54 63.1,103.3 63.1,100.87 63.36,101 63.48,100.87 63.52,100.9 ARDUINO_DUE1.8
9
  Bottom 0.8: 156.36,70.44 157.88,70.44 157.88,117.02 156.36,117.02 156.36,116.98
  Bottom 0.813: 156.36,70.44 144.57,70.44
  Bottom 1.016: ARDUINO_DUE1.9 65.57,103.44 65.01,104.01 65.01,105.95 64.88,160.81 139.18,160.81 139.3,117 148.57,117 149.2,116.98 156.36,116.98 | JP11.4 139.05,59.88 139.25,59.88 140.62,60.51 143.62,60.45 144.57,60.45 144.57,70.44
9V  (via drill 1 pad 1.3)
  Top 1.016: v118.57,116.45 v118.57,124.45 | v114.57,191.96 114.56,189.46 v114.69,175.93 | v119.57,173.45 v119.57,162.97 | v124.31,162.58 v124.31,152.45
  Bottom 1: LED1.A 85.33,194.78 C1.+ 103.74,194.78 103.74,191.96
  Bottom 1.016: v118.57,124.45 118.57,152.45 v124.31,152.45 | 103.74,191.96 v114.57,191.96 | v114.69,175.93 114.57,174.81 114.57,173.45 v119.57,173.45 | v119.57,162.97 119.57,163.45 120.31,162.58 v124.31,162.58 | ARDUINO_DUE1.VIN 118.57,96.84 v118.57,116.45
  Bottom 1.27: 103.74,191.96 1-1.OUT | LED1.A 1-2.IN
10
  Bottom 0.8: 136.76,114.46 136.76,114.71 156.47,114.71 156.47,72.7 142.57,72.7
  Bottom 0.813: 142.57,72.7 142.57,72.45
  Bottom 1: 67.57,106.45 67.55,106.45 67.55,109.45
  Bottom 1.016: 67.55,109.45 67.42,158.91 136.64,158.91 136.76,114.46 | 67.57,106.45 68.03,105.98 ARDUINO_DUE1.10 | JP11.2 142.57,65.34 142.57,72.45
11
  Bottom 1.016: ARDUINO_DUE1.11 75.34,108.45 70.57,108.45 70.09,108.93 70.09,156.92 134.22,156.92 134.22,111.92 139.13,111.92 139.13,101.01 137.34,99.22 JP8.4
12
  Bottom 1.016: JP8.2 136.84,104.3 136.84,109.38 131.68,109.38 131.68,155.02 72.63,155.02 72.63,111.51 72.57,111.45 72.95,111.06 ARDUINO_DUE1.12
12V
  Bottom 1: 2-7809.IN 181.85,175.42 166.58,175.42 160.4,169.24 139.31,169.24 | 66.57,178.09 70.8,178.09 70.8,175.45 76.57,175.45 | 23.21,165.89 23.21,161.09 20.37,158.25 20.37,152.17 19.65,151.45 14.08,151.45
  Bottom 1.016: 14.08,151.45 14.08,178.32 66.57,178.09 | 139.31,169.24 136.59,172.61 136.59,179.37 123.78,179.37 122.82,180.33 MAIN_POWER.2 | 1-7809.IN 23.21,165.89
  Bottom 1.27: 1-1.IN 98.79,175.8
  Bottom 6: 98.79,175.8 98.79,175.45 | 98.79,175.45 109.48,175.45 109.48,179.76 110.16,180.45 122.57,180.45 122.82,180.7 MAIN_POWER.2 | 98.79,175.45 76.57,175.45 71.57,175.45 71.57,190.94 F1.1
12V2
  Bottom 1: X14.1 184.57,50.93 184.57,50.45 | X13.1 180.57,30.45 184.57,30.45 184.57,39.94 | X17.2 184.57,85.96 184.57,86.45
  Bottom 1.016: 184.57,66.94 X11.2 172.69,66.94 171.57,66.93 | 184.57,66.94 184.57,50.45 184.57,46.45 | 184.57,39.94 184.57,46.45 | X12.2 180.57,46.45 181.57,46.45 | 181.57,46.45 184.57,46.45 | 171.57,66.93 162.2,66.78 162.2,46.12 162.87,45.04 162.89,45.04 IC2.9 165.57,44.37 165.57,38.45 | X18.2 184.57,80.94 | 184.57,102.45 184.57,112.45 180.57,112.45 X15.2 | 184.57,102.45 184.57,86.45 184.57,80.94 | 184.57,80.94 184.57,66.94 | IC3.9 164.97,75.05 171.07,68.95 | 171.57,66.93 171.57,68.44 171.07,68.95 | R12.1 171.53,68.95 171.07,68.95 | R11.1 165.57,36.91 165.57,38.45 | R14.1 165.11,37.99 165.57,38.45 | R13.1 180.03,44.91 181.57,46.45 | X16.2 180.57,102.45 184.57,102.45
22  (via drill 1 pad 1.3)
  Top 1.016: v63.06,98.83 63.06,90.94 v61.57,89.45
  Bottom 1: 77.83,98.8 77.83,98.82 76.57,98.82
  Bottom 1.016: ARDUINO_DUE1.22 77.96,50.3 78.65,50.99 78.53,98.1 77.83,98.8 | JP13.1 61.57,86.78 v61.57,89.45 | 76.57,98.82 63.94,98.82 v63.06,98.83
23
  Bottom 1.016: ARDUINO_DUE1.23 77.96,41.43 62.57,41.43 62.57,56.38 57.77,61.18 IC1.4
24
  Bottom 1: JP16.1 80.52,48.58 ARDUINO_DUE1.24
24V
  Bottom 1: R7.1 34.57,47.45 34.57,44.96
  Bottom 1.016: 18.57,56.96 X10.2 24.57,53.45 R9.1 | 18.57,56.96 18.57,44.96 X3.2 34.57,44.96 50.57,44.96 50.57,71.34 IC1.9 | 18.57,67.96 X8.2 31.52,67.96 R8.1 | 18.57,67.96 18.57,56.96 | 18.57,67.96 18.57,78.96 19.57,78.96 22.57,78.96 X9.2 33.52,78.96 R10.1
25
  Bottom 1.016: ARDUINO_DUE1.25 80.5,39.02 80.38,38.89 60.29,38.89 60.29,43.45 60.31,43.7 60.31,55.94 57.61,58.64 IC1.3
26
  Bottom 1: ARDUINO_DUE1.26 83.04,150.81 JP16.2
27
  Bottom 1.016: ARDUINO_DUE1.27 83.04,36.36 82.79,36.35 58.38,36.35 58.38,55.17 57.46,56.1 IC1.2
28
  Bottom 1: JP16.3 85.6,48.58 ARDUINO_DUE1.28
29
  Bottom 1.016: ARDUINO_DUE1.29 85.58,33.94 85.2,33.94 56.57,33.87 56.31,33.87 56.31,53.56 IC1.1
30
  Bottom 1: JP16.4 88.12,150.81 88.12,77.72 88.01,77.61 88.01,75.38 88.12,75.27 ARDUINO_DUE1.30
31
  Bottom 1.016: R41.2 Q4.E 15.3,117.63 15.3,31.27 88.12,31.27 88.12,31.28 ARDUINO_DUE1.31
32
  Bottom 1: JP16.5 90.68,48.58 ARDUINO_DUE1.32
33
  Bottom 1.016: R44.2 20.56,125.89 Q3.E 12.76,128.43 12.76,128.45 12.89,28.99 90.66,28.99 ARDUINO_DUE1.33
34
  Bottom 1: ARDUINO_DUE1.34 93.2,150.81 JP16.6
35
  Bottom 1.016: R35.2 Q2.E 10.6,142.27 10.6,26.07 93.2,26.19 93.2,26.2 ARDUINO_DUE1.35
36
  Bottom 1: JP16.7 95.76,48.58 ARDUINO_DUE1.36
37
  Bottom 1: 8.32,147.45 18.97,147.45 22.05,150.53 23.56,150.53 Q1.E 26.91,152.56 R38.2
  Bottom 1.016: 8.32,147.45 8.32,146.56 8.32,23.91 95.74,24.03 95.74,24.04 ARDUINO_DUE1.37
38
  Bottom 1: ARDUINO_DUE1.38 98.28,150.81 JP16.8
39
  Bottom 1.016: R62.2 183.29,148.37 Q9.E 194.72,150.02 194.72,22.59 98.28,22.59 ARDUINO_DUE1.39
40
  Bottom 1: JP16.9 100.84,48.58 ARDUINO_DUE1.40
41
  Bottom 1.016: R59.2 Q10.E 192.18,141.13 192.18,24.29 100.82,24.29 ARDUINO_DUE1.41
42
  Bottom 1: ARDUINO_DUE1.42 103.36,150.81 JP16.10
43
  Bottom 1: 189.64,124.9 189.64,128.57 185.92,128.57
  Bottom 1.016: R68.2 185.66,127.75 Q11.E 185.66,128.9 185.92,128.57 | 189.64,124.9 189.64,26.11 103.36,26.11 ARDUINO_DUE1.43
44
  Bottom 1: JP16.11 105.92,48.58 ARDUINO_DUE1.44
45
  Bottom 1: R65.2 185.66,119.09 Q12.E
  Bottom 1.016: Q12.E 187.1,119.73 187.1,27.8 105.9,27.8 ARDUINO_DUE1.45
46
  Bottom 1.016: JP8.1 129.89,106.84 129.89,122.62 109.4,122.62 108.57,120.45 108.57,48.71 ARDUINO_DUE1.46
47
  Bottom 1: 108.44,35.45 108.44,34.45 109.57,34.45
  Bottom 1.016: 109.57,34.45 154.57,34.45 154.57,54.72 IC2.4 | ARDUINO_DUE1.47 108.44,35.45
48
  Bottom 1.016: JP8.3 128.09,101.76 128.09,118.08 126.23,120.45 111.57,120.45 110.98,118.86 ARDUINO_DUE1.48
49
  Bottom 1.016: ARDUINO_DUE1.49 110.98,36.99 152.57,36.99 152.57,57.26 IC2.3
50
  Bottom 1.016: ARDUINO_DUE1.50 113.57,48.63 113.57,53.45 114.57,54.45 120.57,54.45 120.57,71.41 138.67,71.41 JP11.1
51
  Bottom 1.016: 150.57,39.44 113.52,39.53 ARDUINO_DUE1.51 | IC2.2 150.57,59.8 150.57,39.44 | 150.57,39.44
52
  Bottom 1.016: JP11.3 135.49,62.8 135.46,48.93 121.19,48.93 121.19,51.45 116.57,51.45 116.06,50.94 ARDUINO_DUE1.52
53
  Bottom 1: 116.06,42.58 116.06,42.07 116.57,42.07
  Bottom 1.016: 116.57,42.07 148.57,42.07 148.57,62.34 IC2.1 | ARDUINO_DUE1.53 116.06,42.58
222  (via drill 1 pad 2.03)
  Top 4: v10.6,151.91 v17.27,154.8
  Bottom 2.54: F2.2 10.73,183.88
  Bottom 4: 10.73,183.88 v10.6,151.91 | v17.27,154.8 17.27,161.28 X2.2
333
  Bottom 4: X5.1 186.57,18.44 F3.2
444
  Bottom 2.54: F4.2 153.16,174.78
  Bottom 4: 153.16,174.78 160.89,174.78 163.07,178.96 192.32,178.96 X1.2
555
  Bottom 4: X4.1 11.57,18.7 F5.2
A0
  Bottom 1.016: ARDUINO_DUE1.A0 148.88,91.76 149.95,92.83 IC3.1
A1
  Bottom 1.016: ARDUINO_DUE1.A1 149.34,89.22 150.57,90.45 152.46,90.45 IC3.2
A2
  Bottom 1.016: ARDUINO_DUE1.A2 149.8,86.68 150.57,87.45 152.31,87.45 IC3.3
A3
  Bottom 1.016: ARDUINO_DUE1.A3 150.26,84.14 151.57,85.45 152.38,85.45 IC3.4
A4
  Bottom 1.016: ARDUINO_DUE1.A4 132.23,81.6 JP3.4
A5
  Bottom 1.016: ARDUINO_DUE1.A5 132.23,79.06 JP3.3
A6
  Bottom 1.016: ARDUINO_DUE1.A6 132.23,76.52 JP3.2
A7
  Bottom 1.016: ARDUINO_DUE1.A7 132.23,73.98 JP3.1
A8
  Bottom 1.016: JP15.8 128.57,68.95 123.82,68.95 ARDUINO_DUE1.A8
A9
  Bottom 1.016: JP15.7 128.57,66.45 123.82,66.45 ARDUINO_DUE1.A9
A10
  Bottom 1.016: JP15.6 128.82,63.7 123.82,63.7 ARDUINO_DUE1.A10
A11
  Bottom 1.016: JP15.5 128.82,61.2 123.82,61.2 ARDUINO_DUE1.A11
CANRX
  Bottom 1.016: ARDUINO_DUE1.CANRX 123.84,53.5 JP15.2
CANTX
  Bottom 1: ARDUINO_DUE1.CANTX 129.14,51.12 JP15.1
D  (via drill 1 pad 2.03)
  Top 2.54: v63.77,168.97 v63.77,181.74 | v66.91,5.03 v66.91,18.32
  Bottom 4: v63.77,181.74 33.26,181.74 33.26,184.31 | v63.77,168.97 130.59,168.97 F4.1
  Bottom 5: 33.26,184.31 F2.1 33.76,193.45 | F5.1 66.38,18.81 v66.91,18.32 67.04,18.44 F3.1 | F1.2 44.12,193.45 33.76,193.45 | 33.76,193.45 4.13,193.45 4.13,192.46 3.98,4.05 3.98,4 66.91,4 v66.91,5.03
DAC0
  Bottom 1: JP15.4 126.11,58.58 126.11,58.63 123.68,58.63 ARDUINO_DUE1.DAC0
DAC1
  Bottom 1: JP15.3 128.57,56.04 128.57,56.2
  Bottom 1.016: 128.57,56.2 123.82,56.2 ARDUINO_DUE1.DAC1
EN1
  Bottom 1.016: JP2.3 46.85,148.11 46.85,155.1 R37.1 46.66,155.61 R36.1
EN2
  Bottom 1.016: R33.1 R34.1 52.31,144.94 JP2.4
EN3
  Bottom 1.016: JP1.3 47.86,126.52 47.86,130.97 R43.1 R42.1
EN4
  Bottom 1.016: R39.1 R40.1 45.32,120.17 45.32,123.98 JP1.4
EN9
  Bottom 1.016: JP7.3 150.1,146.21 150.1,153.19 R61.1 166.1,153.19 R60.1
EN10
  Bottom 1.016: JP7.4 R58.1 R57.1
EN11
  Bottom 1.016: JP5.3 161.53,133.6 R67.1 R66.1
EN12
  Bottom 1.016: JP5.4 158.35,131.06 158.35,126.27 R64.1 R63.1
GNND  (via drill 1, 1 pad 1.3)  (1 unrouted)
  Top 1.016: v152.57,111.45 v152.57,119.11 | v152.57,119.11
  Top 4: v107.7,164.24 108.16,186.97 v108.15,187.21
  Bottom 0.8: IC3.8 155.04,75.05 155.04,102.45 151.57,102.45
  Bottom 1: U$2.4 61.66,62.92 61.66,63.45 | 44.73,167.8 44.73,168.43 1-7805.GND | R4.1 41.57,160.81 41.57,160.5 | 51.13,77.36 51.13,76.36 54.38,76.36 | 54.38,76.36 JP13.5 | IC1.8 54.38,76.36 | C6.- 192.32,159.54 X1.1 | JP5.2 141.84,136.14 141.84,136.45
  Bottom 1.016: X1.1 190.1,164.06 190.1,168.43 2-7809.GND 178.16,168.43 178.14,172.24 | 141.84,148.75 141.84,141.13 | 141.84,141.13 141.84,136.45 141.84,119.54 151.37,119.54 151.37,119.11 v152.57,119.11 R65.1 170.15,118.73 R68.1 | R62.1 166.61,141.13 R59.1 141.84,141.13 | 178.14,173.39 169.15,173.39 169.15,168.43 | 18.38,174.77 18.38,168.43 1-7809.GND | 34.54,174.77 34.54,168.43 1-7805.GND | 61.66,63.45 61.66,76.36 JP13.5 | R44.1 34.53,117.63 R41.1 51.13,117.63 | JP2.2 55.48,150.65 | 55.48,129.06 JP1.2 | 55.48,150.65 55.48,142.4 | 55.48,142.4 55.48,129.06 | 51.13,117.63 55.48,117.63 55.48,129.06 | R38.1 34.53,142.4 R35.1 55.48,142.4 | 51.13,117.63 51.13,108.49 | 51.13,108.49 51.13,100.49 | 51.13,100.49 51.13,90.45 | 51.13,90.45 51.13,77.36 | JP4.5 51.13,100.49 | 41.57,160.5 C3.- 44.73,160.81 44.73,167.8 | 2-7805.GND 169.15,168.43 | 169.15,168.23 169.15,168.43 | 55.48,150.65 C5.2 58.57,160.09 58.57,164.24 | R3.1 55.48,164.24 | ARDUINO_DUE1.GND_3 138.63,46.04 138.67,46.01 JP11.5 146.37,57.72 146.37,65.45 160.2,65.45 160.2,44.56 IC2.8 | ARDUINO_DUE1.GND_1 127.2,99.38 127.24,99.34 127.24,96.68 JP8.5 137.8,96.68 140.57,99.45 142.57,102.37 GND1.1 GND1.2 GND1.3 GND1.4 151.57,102.45 GND1.5 152.57,102.37 v152.57,111.45 | U$1.GND1 50.89,108.6 51.13,108.49 | GND.1 GND.2 GND.3 GND.4 GND.5 51.13,90.45
  Bottom 1.27: JP7.2 141.84,148.75 141.84,165.45 | 101.2,181.74 105.54,181.74 108.69,187.68 | 108.38,187.45 108.69,187.68 | 108.69,187.68 109.39,188.21 | 1-2.GND 87.87,189.21 R1.1 92.82,189.21 C1.- 92.82,192.09 101.2,192.09 C2.2 1-1.GND 101.2,181.74 | 101.2,181.74 R2.1 | R5.1 178.14,170.97 178.14,172.24 178.14,173.39 | X7.GND 187.72,186.23 176.91,185.66 | v107.7,164.24 108.36,164.24 109.57,165.45 141.84,165.45 | 141.84,165.45 158.2,165.45 R6.1 158.47,166.96 164.24,166.96 C4.- 169.07,168.31 169.15,168.23 | X6.GND 169.91,186.32 170.57,185.66
  Bottom 4: v107.7,164.24 58.57,164.24 55.48,164.24 55.48,174.6 34.54,174.77 18.38,174.77 18.08,172.45 X2.1 | 108.38,187.45 v108.15,187.21 108.38,187.45
  Bottom 6: 181.78,185.66 176.91,185.66 | 176.91,185.66 200.36,185.68 200.36,161.45 X1.1 200.28,161.45 200.28,16.7 X5.2 196.57,9.91 181.23,9.91 181.23,11.47 22.24,11.47 21.74,11.97 X4.2 | MAIN_POWER.1 132.82,194.55 151.57,194.55 151.57,185.66 170.57,185.66 176.91,185.66
N$2
  Bottom 1.016: LED12.K 172.38,64.72 R12.2
N$3
  Bottom 1.27: LED1.K 82.15,192.39 R1.2
N$7
  Bottom 1: LED2.A 91.25,180.9 91.25,181.96 95.57,186.28 95.57,188.45 96.76,189.64 98.45,189.64 C2.1
N$8
  Bottom 1.016: R3.2 LED4.K
N$9
  Bottom 1.016: R4.2 LED3.K
N$10
  Bottom 1: 2-7809.OUT 181.61,165.89 C6.+ 181.61,158.91 LED5.A
  Bottom 1.016: 2-7809.OUT 175.86,165.89 175.86,170.97 2-7805.IN
N$11
  Bottom 1.27: R2.2 95.6,180.84 LED2.K
N$12
  Bottom 1.27: R5.2 178.04,161.45 LED5.K
N$13
  Bottom 1.27: R6.2 158.2,160.85 LED6.K
N$14
  Bottom 1.016: R11.2 171.57,36.91 LED11.K
N$16
  Bottom 1.016: LED13.K R13.2
N$17
  Bottom 1.016: R14.2 163.57,31.45 LED14.K
N$18
  Bottom 1: R10.2 39.11,81.31 LED10.K
N$19
  Bottom 1.016: R9.2 38.38,53.18 LED9.K
N$20
  Bottom 1: 31.02,166.91 31.02,165.89 | 31.02,165.89 36.43,165.89 | LED3.A 29.1,163.45 31.02,163.45 31.02,165.89 | 1-7805.IN 42.34,165.89 C3.+
  Bottom 1.016: 1-7809.OUT 31,170.97 31.02,166.91 | 36.43,165.89 1-7805.IN
N$21
  Bottom 1.016: R8.2 37.84,68.18 LED8.K
N$22
  Bottom 1.016: R7.2 40.84,47.18 LED7.K
N$30
  Bottom 1.016: R33.2 Q2.B
N$31
  Bottom 1.016: R36.2 26.91,155.1 Q1.B
N$33
  Bottom 1.016: R39.2 Q4.B
N$34
  Bottom 1.016: R42.2 Q3.B
N$39
  Bottom 1.016: Q10.B R57.2
N$40
  Bottom 1: R60.2 183.29,152.94 Q9.B
N$41
  Bottom 1: Q12.B 178.04,122.27 R63.2
N$42
  Bottom 1: Q11.B 175.77,134.7 R66.2
O1
  Bottom 1.016: X3.1 43.57,49.96 | IC1.16 46.76,49.96 43.57,49.96 | LED7.A 43.57,49.96
O2
  Bottom 1.016: X10.1 28.57,61.96 28.57,56.1 42.22,56.1 | LED9.A 41.57,55.45 42.22,56.1 | IC1.15 42.22,56.1
O3
  Bottom 1.016: IC1.14 34.57,58.64 34.57,72.96 | X8.1 34.57,72.96 | LED8.A 34.78,72.96 34.57,72.96
O4
  Bottom 1.016: X9.1 41.57,83.96 | 41.57,83.96 43.57,83.96 43.57,61.18 IC1.13 | LED10.A 41.59,83.94 41.57,83.96
O5
  Bottom 1.016: X11.1 171.38,61.93 167.55,62.19 | 167.55,62.19 IC2.16 | LED12.A 167.56,62.18 167.55,62.19
O6
  Bottom 1: X14.2 172.57,55.94 | 172.57,55.94 172.19,55.94 172.19,55.45 | LED13.A 172.57,54.72 172.57,55.94
  Bottom 1.016: IC2.15 172.19,59.8 172.19,55.45
O7
  Bottom 1.016: IC2.14 169.68,57.39 169.68,41.58 | 169.68,41.58 180.57,41.45 X12.1 | LED11.A 170.46,41.72 169.68,41.58
O8
  Bottom 1: 167.82,30.93 174.57,30.93 174.57,34.94 X13.2 | LED14.A 167.82,31.45 167.82,32.45
  Bottom 1.016: IC2.13 167.82,54.72 167.82,32.45 167.82,30.93
O9
  Bottom 1.016: IC3.16 160.24,93.83 160.36,106.93 X15.1
O10
  Bottom 1.016: IC3.15 171.41,90.29 171.05,96.93 X16.1
O11
  Bottom 1: X17.1 173.57,90.96 173.57,87.75
  Bottom 1.016: IC3.14 173.57,87.75
O12
  Bottom 1.016: IC3.13 170.81,85.21 176.57,79.45 176.57,76.45 177.08,75.93 X18.1
RX0
  Bottom 1: U$2.3 69.85,65.46 72.57,68.19 72.57,77.91 73.72,79.06 ARDUINO_DUE1.0
TX0
  Bottom 1: ARDUINO_DUE1.1 75.27,81.45 71.57,81.45 70.57,80.45 70.57,68.45 70.12,68 U$2.2
VCC
  Bottom 1: R64.2 165.94,131.35 166.12,131.53 170.42,131.53 170.42,138.95 169.14,138.95 169.14,138.78 R67.2
  Bottom 1.016: JP7.1 146.29,158.27 R61.2 | 153.32,158.27 R61.2 | 165.59,158.27 169.15,158.27 169.02,150.78 169.02,150.77 169.14,138.95 | 165.59,158.27 LED6.A 153.32,158.27 | JP5.1 161.53,138.68 R67.2 | 165.59,158.27 C4.+ 172.32,165.26 | R61.2 153.32,158.45 153.32,158.27
  Bottom 1.27: R58.2 153.27,150.64 169.02,150.77 | 172.32,165.26 2-7805.OUT
VCC1
  Bottom 1: 1-7805.OUT 46.78,170.97 46.78,169.97
  Bottom 1.016: R34.2 42.78,151.29 37.7,151.29 37.7,153.19 31.99,153.19 | 31.99,153.19 31.99,158.27 46.78,158.27 | 46.78,158.27 R37.2 46.78,161.45 | 31.99,136.05 R43.2 52.31,136.05 JP1.1 | 31.99,128.43 31.99,136.05 | R40.2 42.78,128.43 31.99,128.43 | 31.99,153.19 31.99,136.05 | 46.78,169.97 46.78,161.45 | 46.78,158.27 49.59,158 49.86,156.37 49.86,153.19 JP2.1 52.31,157 C5.1 | LED4.A 46.78,161.45 | U$1.VIN 34.57,106.06 | 31.99,128.43 31.99,108.6 34.57,108.6 34.57,106.06 | VCC_REG.5 VCC_REG.4 VCC_REG.3 VCC_REG.2 VCC_REG.1 34.57,95.37 34.57,106.06
VCC2
  Bottom 1.27: 1-2.OUT 90.41,183.83 88.3,181.72 78.74,181.72 78.61,199.61 159.21,199.61 176.57,199.67 | 176.57,199.67 194.64,199.74 194.71,193.34 X7.VBUS | X6.VBUS 176.57,193.78 176.57,199.67